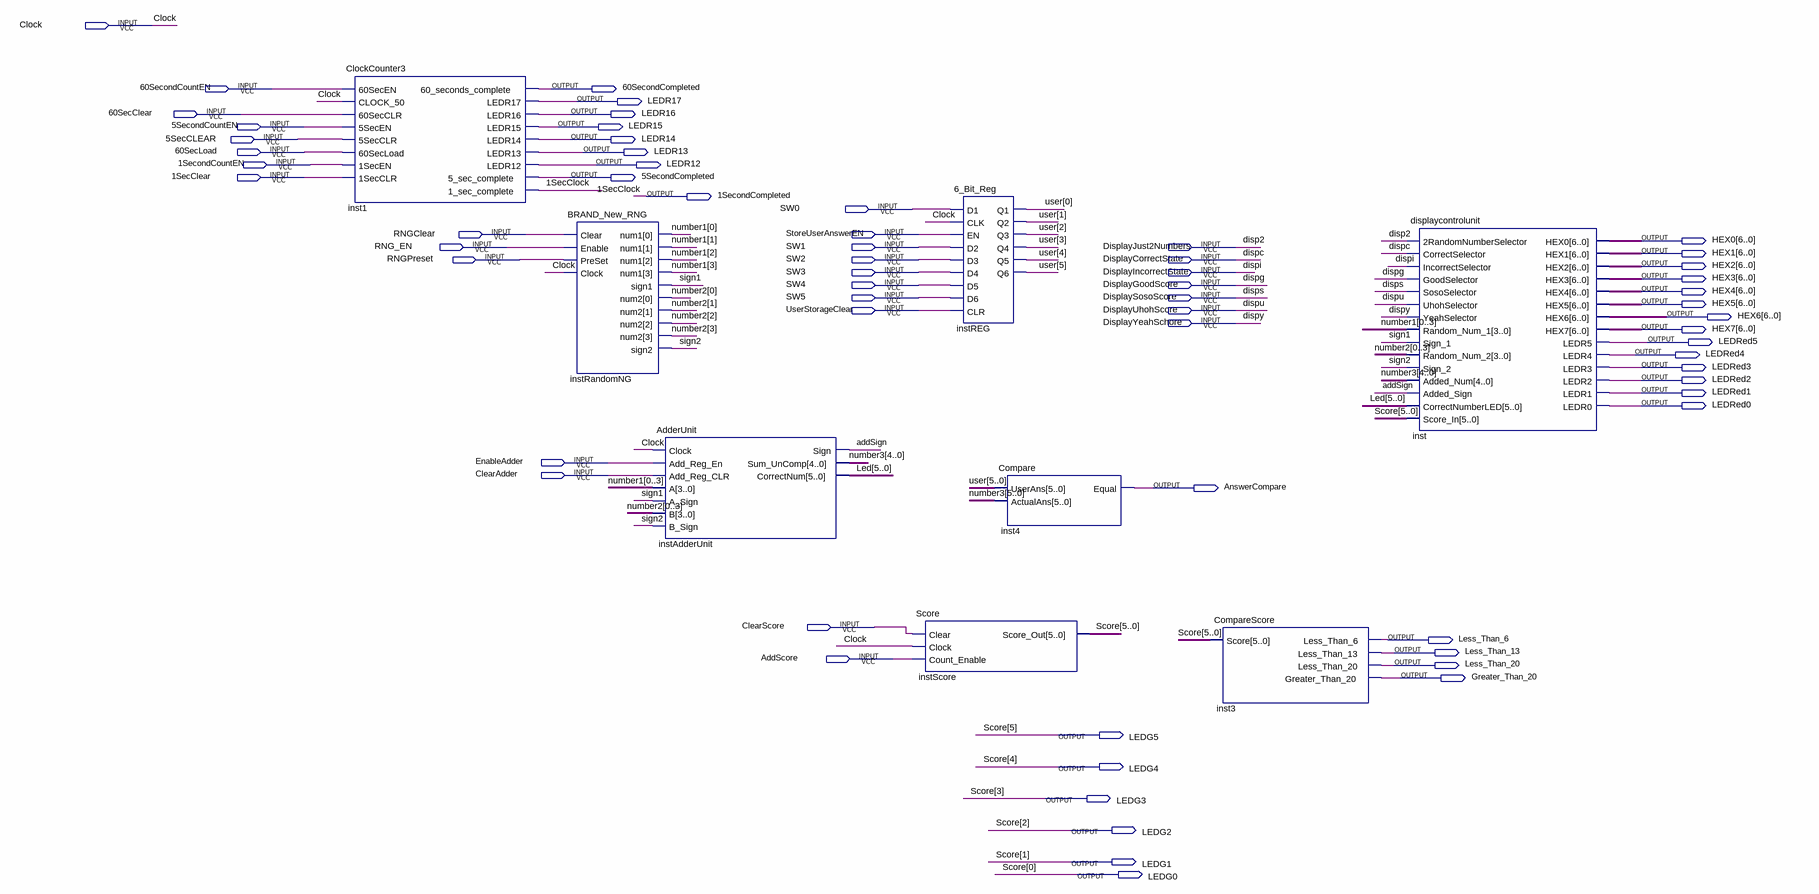
[diagram p0: schematic sheet]
// Quartus schematic DataUnit.bdf as structural Verilog: 8 symbols, 64 pins
module DataUnit (
  input  Clock,
  input  \60SecondCountEN ,
  input  \60SecClear ,
  input  \5SecondCountEN ,
  input  \5SecCLEAR ,
  input  \60SecLoad ,
  input  \1SecondCountEN ,
  input  \1SecClear ,
  input  SW0,
  input  RNGClear,
  input  StoreUserAnswerEN,
  input  RNG_EN,
  input  SW1,
  input  DisplayJust2Numbers,
  input  RNGPreset,
  input  SW2,
  input  DisplayCorrectState,
  input  SW3,
  input  DisplayIncorrectState,
  input  SW4,
  input  DisplayGoodScore,
  input  SW5,
  input  DisplaySosoScore,
  input  UserStorageClear,
  input  DisplayUhohScore,
  input  DisplayYeahSchore,
  input  EnableAdder,
  input  ClearAdder,
  input  ClearScore,
  input  AddScore,
  output \60SecondCompleted ,
  output LEDR17,
  output LEDR16,
  output LEDR15,
  output LEDR14,
  output LEDR13,
  output LEDR12,
  output \5SecondCompleted ,
  output \1SecondCompleted ,
  output [6:0] HEX0,
  output [6:0] HEX1,
  output [6:0] HEX2,
  output [6:0] HEX3,
  output [6:0] HEX4,
  output [6:0] HEX5,
  output [6:0] HEX6,
  output [6:0] HEX7,
  output LEDRed5,
  output LEDRed4,
  output LEDRed3,
  output LEDRed2,
  output LEDRed1,
  output LEDRed0,
  output AnswerCompare,
  output Less_Than_6,
  output Less_Than_13,
  output Less_Than_20,
  output Greater_Than_20,
  output LEDG5,
  output LEDG4,
  output LEDG3,
  output LEDG2,
  output LEDG1,
  output LEDG0
);

  wire addSign, sign1, sign2;
  wire [3:0] number1, number2;
  wire [5:0] Led, number3, user;

  ClockCounter3 inst1 (
    .\60SecEN (\60SecondCountEN ), .CLOCK_50(Clock), .\60SecCLR (\60SecClear ), .\5SecEN (\5SecondCountEN ),
    .\5SecCLR (\5SecCLEAR ), .\60SecLoad (\60SecLoad ), .\1SecEN (\1SecondCountEN ), .\1SecCLR (\1SecClear ),
    .\60_seconds_complete (\60SecondCompleted ), .LEDR17(LEDR17), .LEDR16(LEDR16), .LEDR15(LEDR15),
    .LEDR14(LEDR14), .LEDR13(LEDR13), .LEDR12(LEDR12), .\5_sec_complete (\5SecondCompleted ),
    .\1_sec_complete (\1SecondCompleted ));
  BRAND_New_RNG instRandomNG (
    .Clear(RNGClear), .Enable(RNG_EN), .PreSet(RNGPreset), .Clock(Clock), .num1(number1), .sign1(sign1),
    .num2(number2), .sign2(sign2));
  AdderUnit instAdderUnit (
    .Clock(Clock), .Add_Reg_En(EnableAdder), .Add_Reg_CLR(ClearAdder),
    .A({number1[0], number1[1], number1[2], number1[3]}), .A_Sign(sign1),
    .B({number2[0], number2[1], number2[2], number2[3]}), .B_Sign(sign2), .Sign(addSign),
    .Sum_UnComp(number3[4:0]), .CorrectNum(Led));
  \6_Bit_Reg  instREG (
    .D1(SW0), .CLK(Clock), .EN(StoreUserAnswerEN), .D2(SW1), .D3(SW2), .D4(SW3), .D5(SW4), .D6(SW5),
    .CLR(UserStorageClear), .Q1(user[0]), .Q2(user[1]), .Q3(user[2]), .Q4(user[3]), .Q5(user[4]), .Q6(user[5]));
  Score instScore (
    .Clear(ClearScore), .Clock(Clock), .Count_Enable(AddScore),
    .Score_Out({LEDG5, LEDG4, LEDG3, LEDG2, LEDG1, LEDG0}));
  Compare inst4 (.UserAns(user), .ActualAns(number3), .Equal(AnswerCompare));
  CompareScore inst3 (
    .Score({LEDG5, LEDG4, LEDG3, LEDG2, LEDG1, LEDG0}), .Less_Than_6(Less_Than_6),
    .Less_Than_13(Less_Than_13), .Less_Than_20(Less_Than_20), .Greater_Than_20(Greater_Than_20));
  displaycontrolunit inst (
    .\2RandomNumberSelector (DisplayJust2Numbers), .CorrectSelector(DisplayCorrectState),
    .IncorrectSelector(DisplayIncorrectState), .GoodSelector(DisplayGoodScore),
    .SosoSelector(DisplaySosoScore), .UhohSelector(DisplayUhohScore), .YeahSelector(DisplayYeahSchore),
    .Random_Num_1({number1[0], number1[1], number1[2], number1[3]}), .Sign_1(sign1),
    .Random_Num_2({number2[0], number2[1], number2[2], number2[3]}), .Sign_2(sign2),
    .Added_Num(number3[4:0]), .Added_Sign(addSign), .CorrectNumberLED(Led),
    .Score_In({LEDG5, LEDG4, LEDG3, LEDG2, LEDG1, LEDG0}), .HEX0(HEX0), .HEX1(HEX1), .HEX2(HEX2),
    .HEX3(HEX3), .HEX4(HEX4), .HEX5(HEX5), .HEX6(HEX6), .HEX7(HEX7), .LEDR5(LEDRed5), .LEDR4(LEDRed4),
    .LEDR3(LEDRed3), .LEDR2(LEDRed2), .LEDR1(LEDRed1), .LEDR0(LEDRed0));

  // Other names for the same wires on the sheet: 1SecClock = \1SecondCompleted ; disp2 = DisplayJust2Numbers;
  //   dispc = DisplayCorrectState; dispg = DisplayGoodScore; dispi = DisplayIncorrectState; disps = DisplaySosoScore;
  //   dispu = DisplayUhohScore; dispy = DisplayYeahSchore; Score[5:0] = {LEDG5, LEDG4, LEDG3, LEDG2, LEDG1, LEDG0}
endmodule
